# Altium schematic sheet Sen_PF.SchDoc
size A4
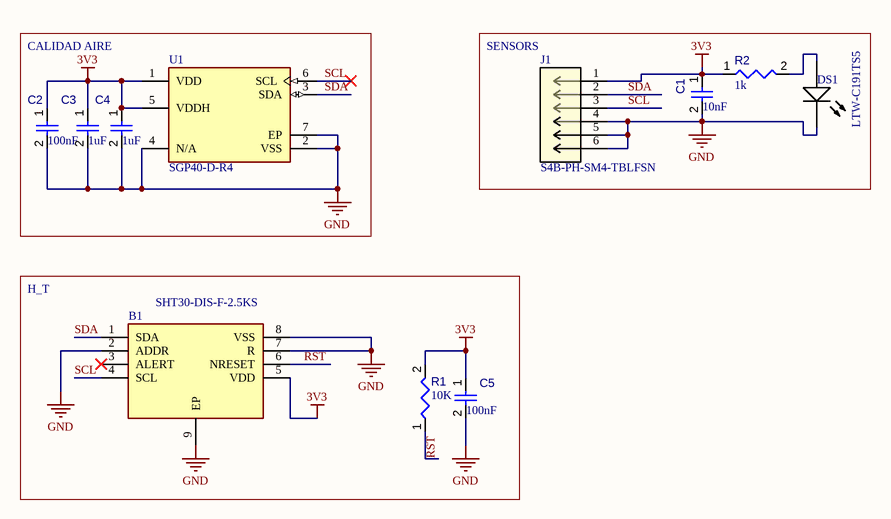
[diagram p0: Sen_PF.SchDoc]

## Parts
B1  SHT30-DIS-F-2.5KS  [SON50P250X250X100-9N-D]
C1  value 10nF  [CAPC1608X90X40ML10T20]  (hidden comment: Capacitor 100 nF +/-10% 50 V 0603)
C2  value 100nF  [CAPC1608X90X40NL10T20]  (hidden comment: Capacitor 100 nF +/-10% 50 V 0603)
C3  value 1uF  [CAPC1608X90X40NL10T20]  (hidden comment: Capacitor 100 nF +/-10% 50 V 0603)
C4  value 1uF  [CAPC1608X90X40NL10T20]  (hidden comment: Capacitor 100 nF +/-10% 50 V 0603)
C5  value 100nF  [CAPC1608X90X40NL10T20]  (hidden comment: Capacitor 100 nF +/-10% 50 V 0603)
DS1  LTW-C191TS5  [LTST-LTW-C191TS5_V]
J1  S4B-PH-SM4-TBLFSN  [CONN_S4B-PH-SM4-TBLFSN_JST]
R1  value 10K  [RESC1608X55X25ML10T15]  (hidden comment: Resistor 10k +/-1% 0603 100 mW)
R2  value 1k  [RESC1608X55X25ML10T15]  (hidden comment: Resistor 10k +/-1% 0603 100 mW)
U1  SGP40-D-R4  [FP-SGP40-D-R4-MFG]

## Blocks framed on the sheet
CALIDAD AIRE: C2-C4 U1
SENSORS: C1 DS1 J1 R2
H_T: B1 C5 R1

## Nets
3V3: B1.5(VDD) C1.1 C2.1 C3.1 C4.1 C5.1 J1.1 R1.2 R2.1 U1.1(VDD) U1.5(VDDH)
GND: B1.2(ADDR) B1.7(R) B1.8(VSS) B1.9(EP) C1.2 C2.2 C3.2 C4.2 C5.2 DS1.2(K) J1.4 J1.5 J1.6 U1.2(VSS) U1.4(N/A) U1.7(EP)
RST: B1.6(NRESET) R1.1
SCL: B1.4(SCL) J1.3 U1.6(SCL)
SDA: B1.1(SDA) J1.2 U1.3(SDA)
NetDS1_1: DS1.1(A) R2.2

Not connected (* = marked no-connect by the designer): B1 3(ALERT)*

## Library data of the parts
B1 = SHT30-DIS-F-2.5KS: Humidity and Temperature Sensor; Manufacturer_Name: Sensirion; Geometry.Height: 1mm; Manufacturer_Part_Number: SHT30-DIS-F-2.5KS; Mouser Part Number: *; Mouser Price/Stock: *; Arrow Part Number: SHT30-DIS-F-2.5KS; Arrow Price/Stock: https://www.arrow.com/en/products/sht30-dis-f2.5ks/sensirion-ag?region=nac; Datasheet Link: https://static6.arrow.com/aropdfconversion/a14bfadde927169fc46d3a4a474fa60e1ffc5e38/sensirion_humidity_sensors_sht3x_datasheet_digital.pdf
C1-C5 = CMP-001-00017-6: Chip Capacitor, 100 nF, +/- 10%, 50 V, 0603 (1608 Metric); Capacitor Type: Ceramic; Voltage Rating: 50V; Max Operating Temperature: 125°C; Min Operating Temperature: -55°C; Case/Package: 0603; Mounting Technology: SM; Pins: 2; Tolerance: 10%; RoHS Compliant: True
DS1 = CMP-007-00027-2: LED Uni-Color White, 70 mW, 20 mA, -20 to 80 degC, 2-Pin SMD, RoHS, Tape and Reel; Manufacturer: Lite-On; Power: 70mW; Forward Current: 5mA; Viewing Angle: 130degrees; Luminous Intensity: 28mcd; Lens Style: Diffused; Nominal Vf: 2.93V; Forward Voltage: 3.15V; Pins: 2; Illumination Colour: White; Datasheet Version: Rev. B, 06/2010; Package Quantity: 1; Colour: White; Package Reference: LTW-C191TS5; Mounting Technology: SM; Package Description: 2-Pin Surface Mount Device, Body 1.6 x 0.8 mm; Manufacturer URL: http://www.us.liteon.com/; Datasheet URL: http://optoelectronics.liteon.com/upload/download/DS22-2004-201/S_110_LTW-C191TS5.pdf; Max Operating Temperature: 80°C; Case/Package: 0603; RoHS Compliant: True; Min Operating Temperature: -20°C; Packaging: TapeandReel
J1 = S4B-PH-SM4-TBLFSN: No Description Available; Mfr_Name: JST; RefDes: RefDes; Type: Type
R1 R2 = CMP-009-00017-5: Chip Resistor, 10 KOhm, +/- 1%, 01 W, -55 to 155 degC, 0603 (1608 Metric); Voltage Rating: 50V; Power: 100mW; RoHS Compliant: True; Min Operating Temperature: -55°C; Pins: 2; Case/Package: 0603; Mounting Technology: SM; Max Operating Temperature: 155°C; Tolerance: 1%
U1 = CMP-144026-000004-1: AIR QUALITY GAS SENSOR FOR VOC'S